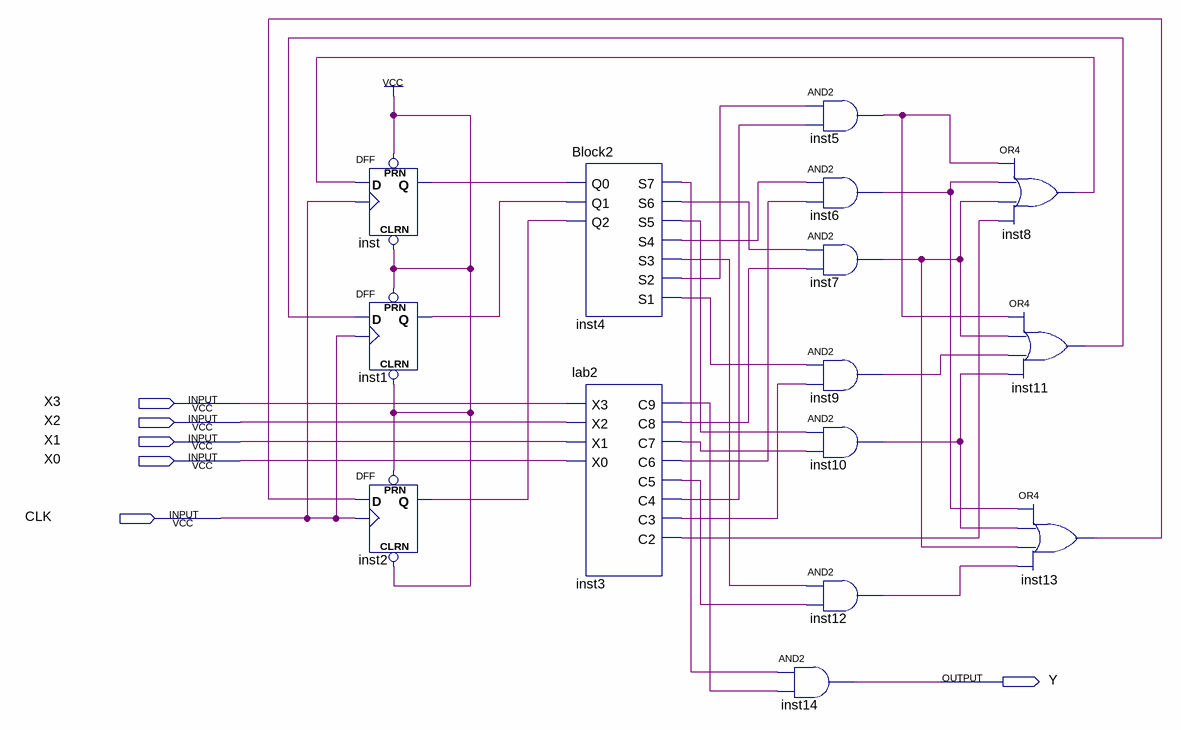
[diagram p0: schematic sheet]
// Quartus schematic Block3.bdf as structural Verilog: 15 symbols, 6 pins
module Block3 (
  input  X3,
  input  X2,
  input  X1,
  input  X0,
  input  CLK,
  output Y
);

  wire inst1_q, inst2_q, inst3_c2, inst3_c3, inst3_c4, inst3_c5, inst3_c6, inst3_c7, inst3_c8, inst3_c9,
       inst4_s1, inst4_s2, inst4_s3, inst4_s4, inst4_s5, inst4_s6, inst4_s7, inst5_out, inst6_out, inst7_out,
       inst8_out, inst9_out, inst10_out, inst11_out, inst12_out, inst13_out, inst_q;

  DFF inst (.CLRN(1'b1), .CLK(CLK), .D(inst8_out), .PRN(1'b1), .Q(inst_q));
  DFF inst1 (.CLRN(1'b1), .CLK(CLK), .D(inst11_out), .PRN(1'b1), .Q(inst1_q));
  DFF inst2 (.CLRN(1'b1), .CLK(CLK), .D(inst13_out), .PRN(1'b1), .Q(inst2_q));
  Block2 inst4 (
    .Q0(inst_q), .Q1(inst1_q), .Q2(inst2_q), .S7(inst4_s7), .S6(inst4_s6), .S5(inst4_s5), .S4(inst4_s4),
    .S3(inst4_s3), .S2(inst4_s2), .S1(inst4_s1));
  lab2 inst3 (
    .X3(X3), .X2(X2), .X1(X1), .X0(X0), .C9(inst3_c9), .C8(inst3_c8), .C7(inst3_c7), .C6(inst3_c6),
    .C5(inst3_c5), .C4(inst3_c4), .C3(inst3_c3), .C2(inst3_c2));
  and inst14 (Y, inst4_s7, inst3_c9);
  and inst5 (inst5_out, inst4_s2, inst3_c4);
  and inst6 (inst6_out, inst4_s4, inst3_c6);
  and inst7 (inst7_out, inst4_s6, inst3_c8);
  and inst9 (inst9_out, inst4_s1, inst3_c3);
  and inst10 (inst10_out, inst4_s5, inst3_c7);
  and inst12 (inst12_out, inst4_s3, inst3_c5);
  or inst8 (inst8_out, inst5_out, inst6_out, inst7_out, inst3_c2);
  or inst11 (inst11_out, inst5_out, inst7_out, inst9_out, inst10_out);
  or inst13 (inst13_out, inst6_out, inst10_out, inst7_out, inst12_out);
endmodule
